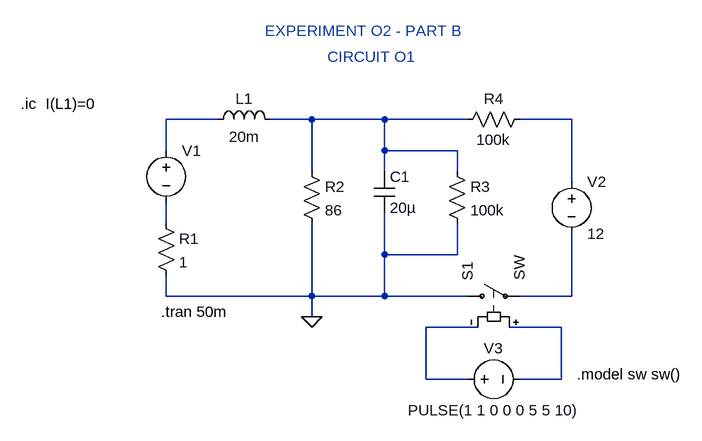
[diagram p0: schematic LTSPICE_CIRCUITO1.asc]
LTSPICE_CIRCUITO1.asc, the LTspice schematic file:
Version 4
SHEET 1 1052 680
WIRE 160 32 80 32
WIRE 304 32 240 32
WIRE 416 32 304 32
WIRE 544 32 416 32
WIRE 704 32 624 32
WIRE 80 80 80 32
WIRE 416 80 416 32
WIRE 528 80 416 80
WIRE 304 112 304 32
WIRE 416 112 416 80
WIRE 528 112 528 80
WIRE 704 128 704 32
WIRE 80 192 80 160
WIRE 416 240 416 176
WIRE 528 240 528 192
WIRE 528 240 416 240
WIRE 80 304 80 272
WIRE 304 304 304 192
WIRE 304 304 80 304
WIRE 416 304 416 240
WIRE 416 304 304 304
WIRE 544 304 416 304
WIRE 704 304 704 208
WIRE 704 304 624 304
WIRE 304 336 304 304
WIRE 560 352 480 352
WIRE 688 352 608 352
WIRE 480 432 480 352
WIRE 544 432 480 432
WIRE 688 432 688 352
WIRE 688 432 624 432
FLAG 304 336 0
SYMBOL res 64 176 R0
SYMATTR InstName R1
SYMATTR Value 1
SYMBOL voltage 80 64 R0
WINDOW 3 24 44 Invisible 2
WINDOW 123 0 0 Left 0
WINDOW 39 0 0 Left 0
SYMATTR Value PULSE(0 12 1u 0 0 100 100 1)
SYMATTR InstName V1
SYMBOL ind 144 48 R270
WINDOW 0 32 56 VTop 2
WINDOW 3 5 56 VBottom 2
SYMATTR InstName L1
SYMATTR Value 20m
SYMATTR SpiceLine IC=0.075
SYMBOL res 288 96 R0
SYMATTR InstName R2
SYMATTR Value 86
SYMBOL cap 400 112 R0
SYMATTR InstName C1
SYMATTR Value 20µ
SYMBOL res 512 96 R0
SYMATTR InstName R3
SYMATTR Value 100k
SYMBOL res 640 16 R90
WINDOW 0 0 56 VBottom 2
WINDOW 3 32 56 VTop 2
SYMATTR InstName R4
SYMATTR Value 100k
SYMBOL voltage 704 112 R0
WINDOW 123 0 0 Left 0
WINDOW 39 0 0 Left 0
SYMATTR InstName V2
SYMATTR Value 12
SYMBOL sw 528 304 R270
SYMATTR InstName S1
SYMBOL voltage 528 432 R270
WINDOW 0 32 56 VTop 2
WINDOW 3 -32 56 VBottom 2
WINDOW 123 0 0 Left 0
WINDOW 39 0 0 Left 0
SYMATTR InstName V3
SYMATTR Value PULSE(1 1 0 0 0 5 5 10)
TEXT 72 328 Left 2 !.tran 50m
TEXT 712 424 Left 2 !.model sw sw()
TEXT -144 8 Left 2 !.ic  I(L1)=0
TEXT 232 -104 Left 2 ;EXPERIMENT O2 - PART B
TEXT 328 -64 Left 2 ;CIRCUIT O1

The netlist it stands for:
* LTSPICE_CIRCUITO1.asc
R1 N004 0 1
V1 N001 N004 PULSE(0 12 1u 0 0 100 100 1)
L1 N001 N002 20m IC=0.075
R2 N002 0 86
C1 N002 0 20µ
R3 N002 0 100k
R4 N003 N002 100k
V2 N003 N005 12
S1 0 N005 N007 N006 SW
V3 N006 N007 PULSE(1 1 0 0 0 5 5 10)
.tran 50m
.model sw sw()
.ic  I(L1)=0
* EXPERIMENT O2 - PART B
* CIRCUIT O1
.backanno
.end